# Altium project Locsolo.PrjPcb
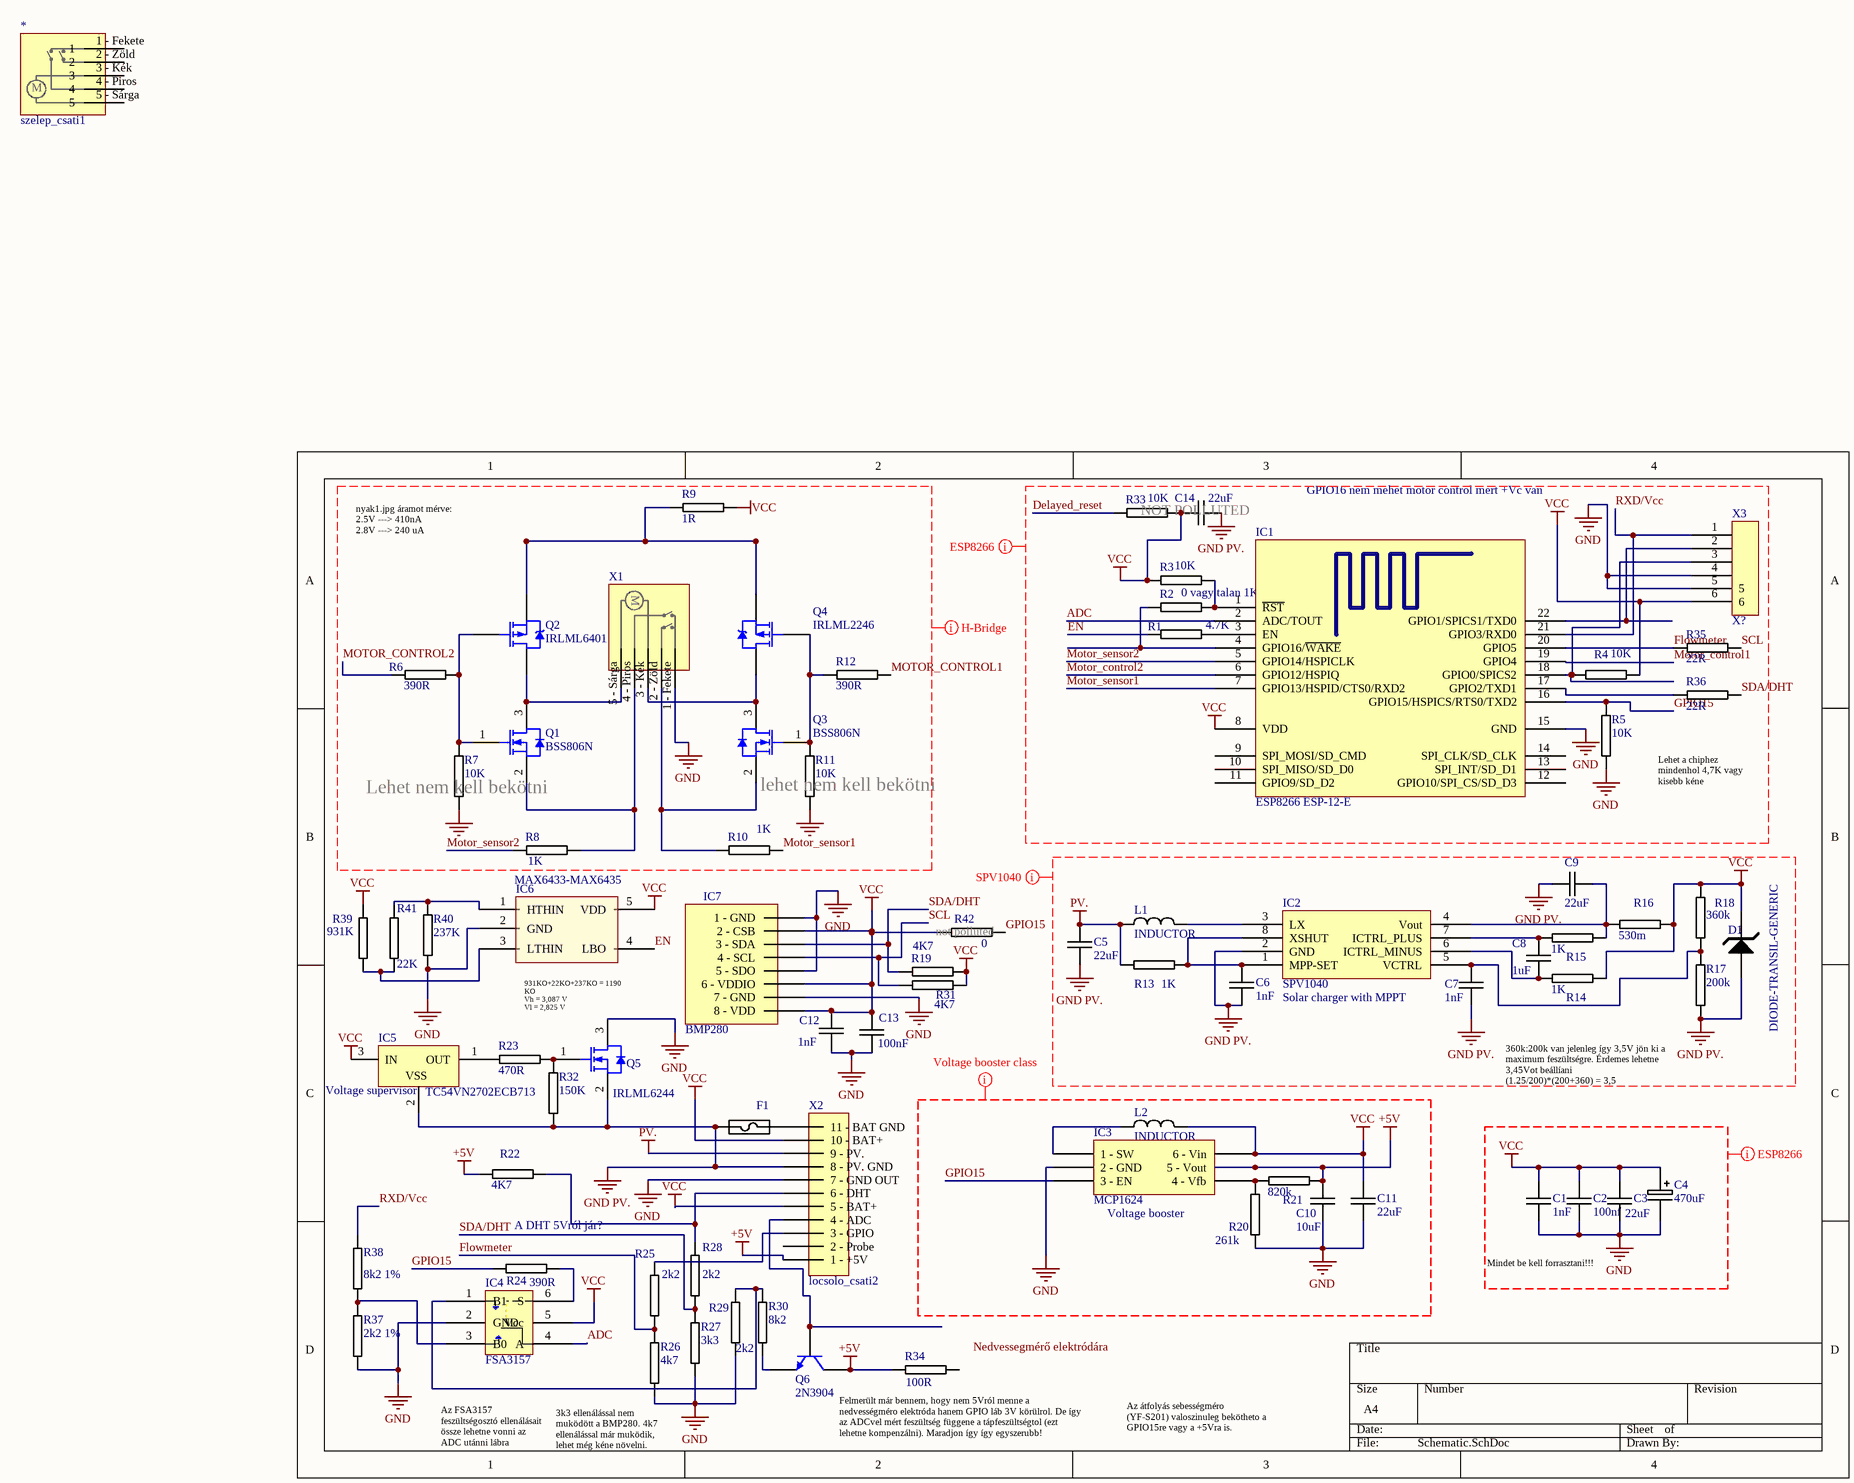
[diagram p0: Schematic.SchDoc]
1 sheet, 77 parts. Net scope: global (net labels, ports and power ports of the same name join across sheets).
Board file: PCB.PcbDoc

## Sheet Schematic.SchDoc
size A4

### Parts
*  szelep_csati1  [Szelep_csati]
C1  1nF  [0805C-TBD]
C2  100nf  [1206C-GENERIC]
C3  22uF  [1206C-GENERIC]
C4  470uF  [PANACAP-D-GENERIC]
C5  22uF  [1206C-GENERIC]
C6  1nF  [0805C-TBD]
C7  1nF  [1206C-GENERIC]
C8  1uF  [0805C-TBD]
C9  22uF  [1206C-GENERIC]
C10  10uF  [1206C-GENERIC]
C11  22uF  [1206C-GENERIC]
C12  1nF  [0805C-GENERIC]
C13  100nF  [0805C-GENERIC]
C14  22uF  [0805C-GENERIC]
D1  DIODE-TRANSIL-GENERIC  [SOD523]
F1  (no value)  [Fuse_1206]
IC1  ESP8266 ESP-12-E  [ESP8266 ESP-12-E]
IC2  SPV1040  [SPV1040]
IC3  MCP1624  [SOT23-6]
IC4  FSA3157  [SC70-6]
IC5  TC54VN2702ECB713  [SOT-23A-CB3_L]
IC6  MAX6433-MAX6435  [SOT23-5]
IC7  BMP280  [BMP280]
L1  INDUCTOR  [Inductor 6x6mm]
L2  INDUCTOR  [INDM2520X190N]
Q1  BSS806N  [INF-PG-SOT23_N]
Q2  IRLML6401  [Micro3_N]
Q3  BSS806N  [INF-PG-SOT23_N]
Q4  IRLML2246  [Micro3_N]
Q5  IRLML6244  [INF-PG-SOT23_N]
Q6  2N3904  [SOT23_N]
R1  4.7K  [0805R-10K]
R2  0 vagy talan 1K?  [1206FB-50Z]
R3  10K  [0805R-10K]
R4  10K  [1206C-GENERIC]
R5  10K  [0805R-10K]
R6  390R  [0805R-390]
R7  10K  [0805R-10K]
R8  1K  [0805R-1K]
R9  1R  [1206FB-50Z]
R10  1K  [0805R-1K]
R11  10K  [0805R-10K]
R12  390R  [0805R-390]
R13  1K  [1206FB-50Z]
R14  1K  [0805R-1K]
R15  1K  [0805R-1K]
R16  530m  [1206FB-50Z]
R17  200k  [0805R-680K]
R18  360k  [0805R-680K]
R19  4K7  [0805R-4K7]
R20  261k  [0805R-820K]
R21  820k  [0805R-560K]
R22  4K7  [0805R-4K7]
R23  470R  [0805R-470]
R24  390R  [0805R-390]
R25  2k2  [0805R-4K7]
R26  4k7  [0805R-4K7]
R27  3k3  [0805R-4K7]
R28  2k2  [0805R-4K7]
R29  2k2  [0805R-4K7]
R30  8k2  [0805R-4K7]
R31  4K7  [0805R-4K7]
R32  150K  [0805R-150K]
R33  10K  [0805R-10K]
R34  100R  [0805R-100]
R35  22R  [0805R-22]
R36  22R  [0805R-22]
R37  2k2 1%  [0805R-1K]
R38  8k2 1%  [0805R-4K7]
R39  931K  [0805R-TBD]
R40  237K  [0805R-TBD]
R41  22K  [0805R-TBD]
R42  0  [0805R-TBD]
X1  Component_1  [Szelep_csati]  (value not drawn)
X2  locsolo_csati2  [locsolo_csati2]
X3  X?  [program port]

### Nets
+5V: C10.1 IC3.5(5_-_Vout) Q6.1(C) R21.2 R22.1 R34.1 X2.1(1_-_+5V)
GND: C1.2 C2.2 C3.2 C4.- C10.2 C11.2 C12.2 C13.2 IC1.15(GND) IC3.2(2_-_GND) IC4.2(GND) IC6.2(GND) IC7.1(1_-_GND) IC7.5(5_-_SDO) IC7.7(7_-_GND) Q5.3(DRAIN) R5.1 R7.2 R11.2 R20.2 R26.1 R27.1 R29.1 R37.1 R40.2 X1.1_-_Fekete X2.7(7_-_GND_OUT) X3.4 X3.5
GND PV.: C5.2 C6.2 C7.2 C9.1 C14.2 D1.A F1.1 IC2.2(GND) IC5.2(VSS) Q5.2(SOURCE) R17.2 R32.2 X2.8(8_-_PV._GND)
PV.: C5.1 L1.1 R13.2 X2.9(9_-_PV.)
VCC: C1.1 C2.1 C3.1 C4.+ C11.1 C12.1 C13.1 C14.1 D1.K IC1.8(VDD) IC3.6(6_-_Vin) IC4.5(Vcc) IC5.3(IN) IC6.5(VDD) IC7.2(2_-_CSB) IC7.6(6_-_VDDIO) IC7.8(8_-_VDD) L2.2 R3.1 R4.2 R9.2 R14.1 R16.1 R18.1 R19.2 R31.2 R33.2 R39.2 R42.1 X2.5(5_-_BAT+) X2.10(10_-_BAT+) X3.6
ADC: IC1.2(ADC/TOUT) IC4.4(A)
Delayed_reset: R33.1
EN: IC6.4(LBO) R1.1
Flowmeter: IC1.20(GPIO5) R25.1 R26.2 R35.2
GPIO15: IC1.16(GPIO15/HSPICS/RTS0/TXD2) IC3.3(3_-_EN) R5.2 R24.1 R42.2
Motor_control1: IC1.19(GPIO4) R12.2
Motor_control2: IC1.6(GPIO12/HSPIQ) R6.1
Motor_sensor1: IC1.7(GPIO13/HSPID/CTS0/RXD2) R10.2
Motor_sensor2: IC1.5(GPIO14/HSPICLK) R8.1
RXD/Vcc: IC1.21(GPIO3/RXD0) R38.1 X3.1
SCL: IC7.4(4_-_SCL) R31.1 R35.1
SDA/DHT: IC7.3(3_-_SDA) R19.1 R27.2 R28.1 R36.1
NetC6_1: C6.1 IC2.1(MPP-SET) IC2.8(XSHUT) R13.1
NetC7_1: C7.1 IC2.5(VCTRL) R17.1 R18.2
NetC8_1: C8.1 IC2.7(ICTRL_PLUS) R15.2
NetC8_2: C8.2 IC2.6(ICTRL_MINUS) R14.2
NetC9_2: C9.2 IC2.4(Vout) R15.1 R16.2
NetF1_2: F1.2 X2.11(11_-_BAT_GND)
NetIC1_1: IC1.1(~{RST}) R2.1 R3.2
NetIC1_3: IC1.3(EN) R1.2
NetIC1_4: IC1.4(GPIO16/~{WAKE}) R2.2
NetIC1_17: IC1.17(GPIO2/TXD1) R36.2
NetIC1_18: IC1.18(GPIO0/SPICS2) R4.1 X3.3
NetIC1_22: IC1.22(GPIO1/SPICS1/TXD0) X3.2
NetIC2_3: IC2.3(LX) L1.2
NetIC3_1: IC3.1(1_-_SW) L2.1
NetIC3_4: IC3.4(4_-_Vfb) R20.1 R21.1
NetIC4_1: IC4.1(B1) R29.2 R30.1
NetIC4_3: IC4.3(B0) R37.2 R38.2
NetIC4_6: IC4.6(S) R24.2
NetIC5_1: IC5.1(OUT) R23.1
NetIC6_1: IC6.1(HTHIN) R40.1 R41.2
NetIC6_3: IC6.3(LTHIN) R39.1 R41.1
NetQ1_1: Q1.1(GATE) Q2.1(G) R6.2 R7.1
NetQ1_2: Q1.2(SOURCE) R8.2 X1.4_-_Piros
NetQ1_3: Q1.3(DRAIN) Q2.3(D) X1.5_-_Sárga
NetQ2_2: Q2.2(S) Q4.2(S) R9.1
NetQ3_1: Q3.1(GATE) Q4.1(G) R11.1 R12.1
NetQ3_2: Q3.2(SOURCE) R10.1 X1.2_-_Zöld
NetQ3_3: Q3.3(DRAIN) Q4.3(D) X1.3_-_Kék
NetQ5_1: Q5.1(GATE) R23.2 R32.1
NetQ6_2: Q6.2(E) R30.2
NetQ6_3: Q6.3(B) X2.4(4_-_ADC)
NetR22_2: R22.2 R28.2 X2.6(6_-_DHT)
NetR25_2: R25.2 X2.3(3_-_GPIO)

Not connected (* = marked no-connect by the designer): * 1 - Fekete(1) 2 - Zöld(2) 3 - Kék(3) 4 - Piros(4) 5 - Sárga(5); IC1 9(SPI_MOSI/SD_CMD) 10(SPI_MISO/SD_D0) 11(GPIO9/SD_D2) 12(GPIO10/SPI_CS/SD_D3) 13(SPI_INT/SD_D1) 14(SPI_CLK/SD_CLK); R34 2; X2 2(2_-_Probe)

### Layout directives
net class Voltage Booster: +5V, GND, GPIO15, VCC
net class SPV1040: GND PV., PV., VCC
net class ESP8266: ADC, Delayed_reset, EN, Flowmeter, GND, GND PV., GPIO15, Motor_control1, Motor_control2, Motor_sensor1, Motor_sensor2, RXD/Vcc, SCL, SDA/DHT, VCC
net class H-Bridge: GND, MOTOR_CONTROL1, MOTOR_CONTROL2, Motor_sensor1, Motor_sensor2, VCC

### Notes on the sheet
- GPIO16 nem mehet motor control mert +Vc van
- nyak1.jpg áramot mérve:
  2.5V ---> 410nA
  2.8V ---> 240 uA
- NOT POLLUTED
- (near R7) Lehet nem kell bekötni
- (near R11) lehet nem kell bekötni
- Lehet a chiphez mindenhol 4,7K vagy kisebb kéne
- (near R42) not polluted
- 931KO+22KO+237KO = 1190 KO
  Vh = 3,087 V
  Vl = 2,825 V
- Solar charger with MPPT
- (near IC5) Voltage supervisor
- 360k:200k van jelenleg így 3,5V jön ki a maximum feszültségre. Érdemes lehetne 3,45Vot beállíani
  (1.25/200)*(200+360) = 3,5
- A DHT 5Vról jár?
- (near IC3) Voltage booster
- Mindet be kell forrasztani!!!
- Az átfolyás sebességméro (YF-S201) valoszinuleg bekötheto a GPIO15re vagy a +5Vra is.
- Az FSA3157 feszültségosztó ellenálásait össze lehetne vonni az ADC utánni lábra
- (near R26) 3k3 ellenálással nem muködött a BMP280. 4k7 ellenálással már muködik, lehet még kéne növelni. Jelenleg a Lipoli feszültségérol táplálom és nincs bekötve a 4k7 ellenálás mert bizonytalan volta BMP280.
- Felmerült már bennem, hogy nem 5Vról menne a nedvességméro elektróda hanem GPIO láb 3V körülrol. De így az ADCvel mért feszültség függene a tápfeszültségtol (ezt lehetne kompenzálni). Maradjon így így egyszerubb!
- Labels drawn without touching a wire or pin: Nedvessegmérő elektródára
- (in symbol szelep_csati1) M

### Library data of the parts
C1 C6 = 0805C-100nF-25V-X7R-MUR: CAPACITOR 0805 CERAMIC; Supplier 1: Digi-Key; Supplier Part Number 1: 490-1673-1-ND
C2 C3 C5 C7 C9-C11 = 1206C-10U-35V-X7R: GENERIC CAPACITOR NON POLARISED 1206; Manufacturer Part Number: GMK316F106ZL-T; Manufacturer: Taiyo Yuden; Reel: C90; Supplier 1: Digi-Key; Supplier Part Number 1: 587-1352-2-ND
C4 = C+47U-6V3: GENERIC CAPACITOR POLARISED; Supplier 1: Digi-Key; Supplier Part Number 1: PCE4375TR-ND
C8 = 0805C-TBD: CAPACITOR 0805 CERAMIC VALUE TO BE DETERMINED
C12 = C0805-GENERIC: 100nF
C13 = C0805-GENERIC
C14 = C0805-GENERIC: GENERIC CAPACITOR NON POLARISED0603
D1 = DIODE-TRANSIL-GENERIC: GENERIC TRANSIL
F1 = Fuse
IC3 = MCP1623
IC5 = TC54VN2702ECB713: 1µA Voltage Detector, Open-Drain Output, 2.7V, 3-Pin SOT-23A, Industrial Temperature, Tape and Reel; Published: 29-Jan-2009; DatasheetVersion: revH, Dec-2007; PackageVersion: revBB, Aug-2009; PackageReference: SOT-23A-CB3; Publisher: Altium Limited; PackageDescription: 3-Lead Plastic Small Outline Transistor (CB) [SOT-23A]; Supplier 1: Digi-Key; Supplier Part Number 1: TC54VN2702ECB71TR-ND; Supplier 2: Digi-Key; Supplier Part Number 2: TC54VN2702ECB71CT-ND; Supplier 3: Digi-Key; Supplier Part Number 3: TC54VN2702ECB71DKR-ND; Supplier 4: Farnell; Supplier Part Number 4: 1292289; ComponentLink1Description: Datasheet; ComponentLink1URL: http://ww1.microchip.com/downloads/en/DeviceDoc/21434h.pdf; ComponentLink2Description: Packaging Specification; ComponentLink2URL: http://www.microchip.com/stellent/groups/techpub_sg/documents/packagingspec/en012702.pdf; ComponentLink3Description: Microchip.com Home; ComponentLink3URL: http://www.microchip.com/
Q1 Q3 Q5 = BSS806N: N-Channel OptiMOS 2 Small-Signal-Transistor, 20 V VDS, 2.3 A ID, -55 to 150 degC, PG-SOT23, Reel, Green; Manufacturer: Infineon; Green: TRUE; ID (max): 2.3 A; IDpuls (max): 9.3 A; Ptot (max): 0.5 W; QG: 1.7 nC; RDS (on) (max): 57 mOhm; RDS (on) (max) (@1.8V): 82 mOhm; RthJA (max): 250 K/W; VDS (max): 20 V; VGS(th) (max): 0.75 V; VGS(th) (min): 0.3 V; DatasheetVersion: Rev. 2.3; PackageVersion: Apr-08; PackageReference: PG-SOT23; PackageDescription: 3-Pin Small Outline Transistor Package, 2.9 x 1.3 mm Body, 0.95 mm Pitch; Halogen-free: TRUE; Packing: Reel; RDS (on) (max) (@2.5V): 57 mOhm; Mounting Technology: Surface Mount; PartNumber: BSS806N; ComponentLink1Description: Manufacturer URL; ComponentLink1URL: http://www.infineon.com/; ComponentLink2Description: Datasheet; ComponentLink2URL: http://www.infineon.com/dgdl/BSS806N_Rev2.3_.pdf?folderId=db3a3043156fd573011622e10b5c1f67&fileId=db3a304330f686060131185f0553451c; ComponentLink3Description: Package Specification; ComponentLink3URL: http://www.infineon.com/dgdl/SOT23-Package_Overview.pdf?folderId=db3a30431936bc4b0119532290053c66&fileId=db3a30431936bc4b0119533468123c85
Q2 Q4 = IRLML6401: HEXFET Power MOSFET; Published: 17-Sep-2003; DatasheetVersion: 2-Jul-2001; PackageVersion: Jul-2001; PackageReference: Micro3; Publisher: Altium Limited; PackageDescription: 3-Pin SOT-23 Package 0.95 mm Pitch, 2.3 mm Lead Span; ComponentLink1Description: Manufacturer Link; ComponentLink1URL: http://www.irf.com/; ComponentLink2Description: Datasheet; ComponentLink2URL: http://www.irf.com/product-info/datasheets/data/IRLML6401.pdf
Q6 = 2N3904: NPN General Purpose Amplifier; Published: 8-Jun-2000; LatestRevisionDate: 17-Jan-2003; LatestRevisionNote: PCB Footprint replaced; DatasheetVersion: 1997; PackageVersion: Sep-1998; PackageReference: TO-92A; Publisher: Altium Limited; PackageDescription: TO, Flat Index; 3 In-Line, Axial Leads; Body Dia. 4.5mm; Leads 0.51 x 0.48 mm (max); ComponentLink1Description: Manufacturer Link; ComponentLink1URL: http://www.fairchildsemi.com/; ComponentLink2Description: Datasheet; ComponentLink2URL: http://www.fairchildsemi.com/ds/2N%2F2N3904.pdf
R1 R3-R5 R7 R11 R33 = 0805R-10K: RESISTOR 0805 1/4 WATT THIN FILM; Reel: *
R2 R9 R13 R16 = 0805R-1R: RESISTOR 0805 1/3 WATT; REEL: R84; Supplier 1: Digi-Key; Supplier Part Number 1: 541-1.0TADKR-ND
R6 R12 R24 = 0805R-390: RESISTOR 0805 1/4 WATT THIN FILM; Reel: *
R8 R10 R14 R15 R37 = 0805R-1K: RESISTOR 0805 1/4 WATT THIN FILM; Reel: *
R17 R18 = 0805R-680K: RESISTOR 0805 1/4 WATT THIN FILM; Reel: *
R19 R22 R25-R31 R38 = 0805R-4K7: RESISTOR 0805 1/4 WATT THIN FILM; Reel: *
R20 = 0805R-820K: RESISTOR 0805 1/4 WATT THIN FILM; Reel: *
R21 = 0805R-560K: RESISTOR 0805 1/4 WATT THIN FILM; Reel: *
R23 = 0805R-470: RESISTOR 0805 1/4 WATT THIN FILM; Reel: *
R32 = 0805R-150K: RESISTOR 0805 1/4 WATT THIN FILM; Reel: *
R34 = 0805R-100: RESISTOR 0805 1/4 WATT THIN FILM; Reel: *
R35 R36 = 0805R-22: RESISTOR 0805 1/4 WATT THIN FILM; Reel: *
R39-R42 = 0805R-TBD: RESISTOR 0805 VALUE TO BE DETERMINED
X1 = szelep_csati1
X3 = program port